# EasyEDA schematic EDA_DriverBoardV1.json
TITLE: Sheet_1; REV: 1.0; Date: 2023-11-25; Sheet: 1/1; Company: Your Company
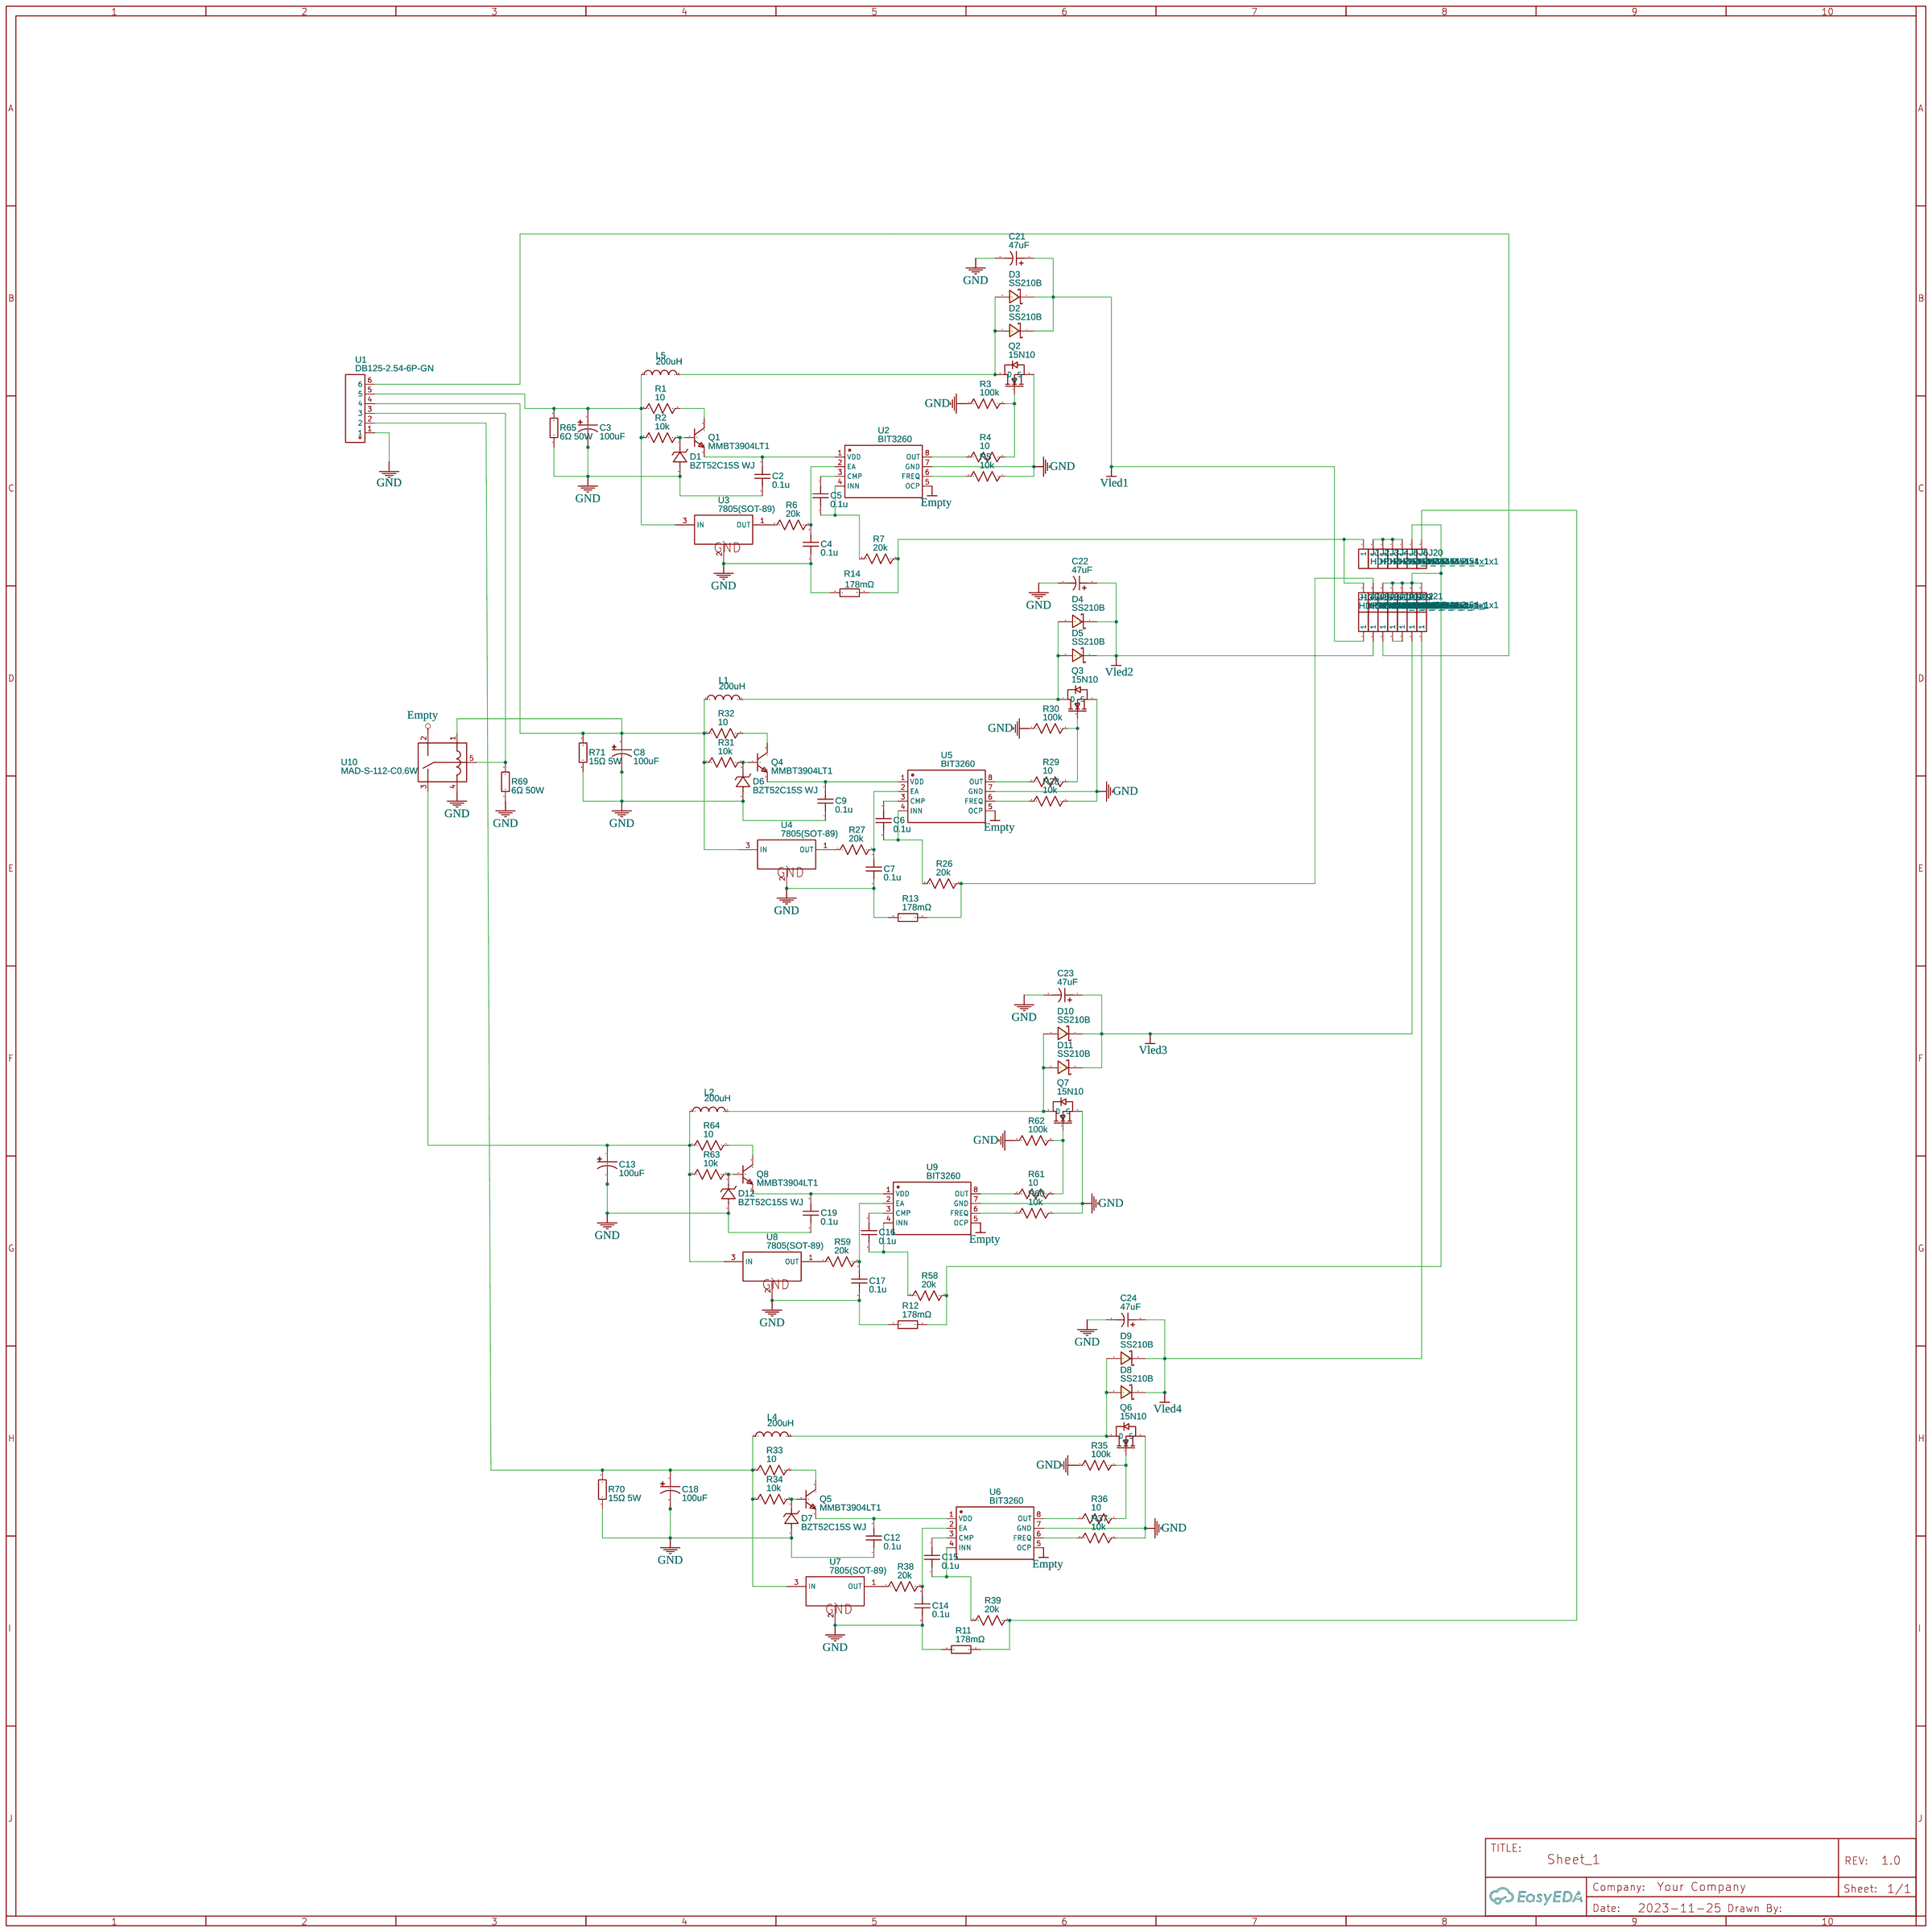
[diagram p0: schematic sheet]

## Parts
C2  0.1u  [C0603]
C3  100uF  [CAP-TH_BD8.0-P3.50-D0.6-FD]
C4  0.1u  [C0603]
C5  0.1u  [C0603]
C6  0.1u  [C0603]
C7  0.1u  [C0603]
C8  100uF  [CAP-TH_BD8.0-P3.50-D0.6-FD]
C9  0.1u  [C0603]
C12  0.1u  [C0603]
C13  100uF  [CAP-TH_BD8.0-P3.50-D0.6-FD]
C14  0.1u  [C0603]
C15  0.1u  [C0603]
C16  0.1u  [C0603]
C17  0.1u  [C0603]
C18  100uF  [CAP-TH_BD8.0-P3.50-D0.6-FD]
C19  0.1u  [C0603]
C21  47uF  [CAP-TH_BD10.0-P5.00-D1.0-FD]
C22  47uF  [CAP-TH_BD10.0-P5.00-D1.0-FD]
C23  47uF  [CAP-TH_BD10.0-P5.00-D1.0-FD]
C24  47uF  [CAP-TH_BD10.0-P5.00-D1.0-FD]
D1  BZT52C15S WJ  [SOD-323_L1.7-W1.3-LS2.5-RD]
D2  SS210B  [SMB_L4.6-W3.6-LS5.3-RD]
D3  SS210B  [SMB_L4.6-W3.6-LS5.3-RD]
D4  SS210B  [SMB_L4.6-W3.6-LS5.3-RD]
D5  SS210B  [SMB_L4.6-W3.6-LS5.3-RD]
D6  BZT52C15S WJ  [SOD-323_L1.7-W1.3-LS2.5-RD]
D7  BZT52C15S WJ  [SOD-323_L1.7-W1.3-LS2.5-RD]
D8  SS210B  [SMB_L4.6-W3.6-LS5.3-RD]
D9  SS210B  [SMB_L4.6-W3.6-LS5.3-RD]
D10  SS210B  [SMB_L4.6-W3.6-LS5.3-RD]
D11  SS210B  [SMB_L4.6-W3.6-LS5.3-RD]
D12  BZT52C15S WJ  [SOD-323_L1.7-W1.3-LS2.5-RD]
J1  HDR-M-2.54_1x1  [HDR-M-2.54_1X1]
J2  HDR-M-2.54_1x1  [HDR-M-2.54_1X1]
J3  HDR-M-2.54_1x1  [HDR-M-2.54_1X1]
J4  HDR-M-2.54_1x1  [HDR-M-2.54_1X1]
J5  HDR-M-2.54_1x1  [HDR-M-2.54_1X1]
J6  HDR-M-2.54_1x1  [HDR-M-2.54_1X1]
J7  HDR-M-2.54_1x1  [HDR-M-2.54_1X1]
J8  HDR-M-2.54_1x1  [HDR-M-2.54_1X1]
J9  HDR-M-2.54_1x1  [HDR-M-2.54_1X1]
J10  HDR-M-2.54_1x1  [HDR-M-2.54_1X1]
J11  HDR-M-2.54_1x1  [HDR-M-2.54_1X1]
J12  HDR-M-2.54_1x1  [HDR-M-2.54_1X1]
J13  HDR-M-2.54_1x1  [HDR-M-2.54_1X1]
J14  HDR-M-2.54_1x1  [HDR-M-2.54_1X1]
J15  HDR-M-2.54_1x1  [HDR-M-2.54_1X1]
J16  HDR-M-2.54_1x1  [HDR-M-2.54_1X1]
J17  HDR-M-2.54_1x1  [HDR-M-2.54_1X1]
J18  HDR-M-2.54_1x1  [HDR-M-2.54_1X1]
J19  HDR-M-2.54_1x1  [HDR-M-2.54_1X1]
J20  HDR-M-2.54_1x1  [HDR-M-2.54_1X1]
J21  HDR-M-2.54_1x1  [HDR-M-2.54_1X1]
L1  200uH  [IND-SMD_L5.0-W5.0_FNR50XXS]
L2  200uH  [IND-SMD_L5.0-W5.0_FNR50XXS]
L4  200uH  [IND-SMD_L5.0-W5.0_FNR50XXS]
L5  200uH  [IND-SMD_L5.0-W5.0_FNR50XXS]
Q1  MMBT3904LT1  [SOT-23-3_L3.0-W1.7-P0.95-LS2.9-BR]
Q2  15N10  [TO-252-3_L6.5-W5.8-P4.58-LS9.8-BR]
Q3  15N10  [TO-252-3_L6.5-W5.8-P4.58-LS9.8-BR]
Q4  MMBT3904LT1  [SOT-23-3_L3.0-W1.7-P0.95-LS2.9-BR]
Q5  MMBT3904LT1  [SOT-23-3_L3.0-W1.7-P0.95-LS2.9-BR]
Q6  15N10  [TO-252-3_L6.5-W5.8-P4.58-LS9.8-BR]
Q7  15N10  [TO-252-3_L6.5-W5.8-P4.58-LS9.8-BR]
Q8  MMBT3904LT1  [SOT-23-3_L3.0-W1.7-P0.95-LS2.9-BR]
R1  10  [R0603]
R2  10k  [R0603]
R3  100k  [R0603]
R4  10  [R0603]
R5  10k  [R0603]
R6  20k  [R0603]
R7  20k  [R0603]
R11  178mΩ  [R1206]
R12  178mΩ  [R1206]
R13  178mΩ  [R1206]
R14  178mΩ  [R1206]
R26  20k  [R0603]
R27  20k  [R0603]
R28  10k  [R0603]
R29  10  [R0603]
R30  100k  [R0603]
R31  10k  [R0603]
R32  10  [R0603]
R33  10  [R0603]
R34  10k  [R0603]
R35  100k  [R0603]
R36  10  [R0603]
R37  10k  [R0603]
R38  20k  [R0603]
R39  20k  [R0603]
R58  20k  [R0603]
R59  20k  [R0603]
R60  10k  [R0603]
R61  10  [R0603]
R62  100k  [R0603]
R63  10k  [R0603]
R64  10  [R0603]
R65  6Ω 50W  [RES-TH_BD2.2-L6.5-P10.50-D0.6]
R69  6Ω 50W  [RES-TH_BD2.2-L6.5-P10.50-D0.6]
R70  15Ω 5W  [RES-TH_BD2.2-L6.5-P10.50-D0.6]
R71  15Ω 5W  [RES-TH_BD2.2-L6.5-P10.50-D0.6]
U1  DB125-2.54-6P-GN  [CONN-TH_DB125-2.54-6P-GN]
U2  BIT3260  [SOP-8_L5.0-W4.0-P1.27-LS6.2-BL]
U3  7805(SOT-89)  [SOT-89-3_L4.5-W2.5-P1.50-LS4.2-BR]
U4  7805(SOT-89)  [SOT-89-3_L4.5-W2.5-P1.50-LS4.2-BR]
U5  BIT3260  [SOP-8_L5.0-W4.0-P1.27-LS6.2-BL]
U6  BIT3260  [SOP-8_L5.0-W4.0-P1.27-LS6.2-BL]
U7  7805(SOT-89)  [SOT-89-3_L4.5-W2.5-P1.50-LS4.2-BR]
U8  7805(SOT-89)  [SOT-89-3_L4.5-W2.5-P1.50-LS4.2-BR]
U9  BIT3260  [SOP-8_L5.0-W4.0-P1.27-LS6.2-BL]
U10  MAD-S-112-C0.6W  [RELAY-TH_MEISHUO_MAD-S-1XX-CXX]

## Library data of the parts
C2 C4-C7 C9 C12 C14-C17 C19 = C_0603_US: Contributor: LCEDA_Lib
C3 C8 C13 C18 = SPZ1HM101F09O00RAXXX: Contributor: LCSC; Supplier: LCSC; Supplier Part: C171434; Manufacturer: AISHI(艾华集团); JLCPCB Part Class: Extended Part; link: https://lcsc.com/eda_search?q=C171434&%26type=1&ref=editor
C21-C24 = SPZ1KM470G12O00RAXXX: Contributor: LCSC; Supplier: LCSC; Supplier Part: C2688263; Manufacturer: AISHI(艾华集团); JLCPCB Part Class: Extended Part; link: https://lcsc.com/eda_search?q=C2688263&%26type=1&ref=editor
D1 D6 D7 D12 = BZT52C15S WJ: Contributor: lcsc; Supplier: LCSC; Supplier Part: C2886375; Manufacturer: CBI(创基); JLCPCB Part Class: Extended Part; link: https://lcsc.com/eda_search?q=C2886375&%26type=1&ref=editor
D2-D5 D8-D11 = SS210B: Contributor: LCSC; Supplier: LCSC; Supplier Part: C353189; Manufacturer: 晶导微电子; JLCPCB Part Class: Extended Part; link: https://lcsc.com/eda_search?q=C353189&%26type=1&ref=editor
J1-J21 = HDR-M-2.54_1x1: Supplier Part: C81276; Supplier: LCSC; Contributor: LCEDA_Lib
L1 L2 L4 L5 = FNR5020S201MT: Contributor: LCSC; Supplier: LCSC; Manufacturer: cjiang(长江微电); Supplier Part: C167949; JLCPCB Part Class: Extended Part; link: https://lcsc.com/eda_search?q=C167949&%26type=1&ref=editor
Q1 Q4 Q5 Q8 = MMBT3904LT1: Contributor: LCSC; Supplier: LCSC; Supplier Part: C402272; Manufacturer: LGE(鲁光); JLCPCB Part Class: Extended Part; link: https://lcsc.com/eda_search?q=C402272&%26type=1&ref=editor
Q2 Q3 Q6 Q7 = 15N10: Contributor: LCSC; Supplier: LCSC; Supplier Part: C2911515; Manufacturer: TF(拓锋); JLCPCB Part Class: Extended Part; link: https://lcsc.com/eda_search?q=C2911515&%26type=1&ref=editor
R1-R7 R26-R39 R58-R64 = R_0603_US: Contributor: LCEDA_Lib
R11-R14 = RTT06R180FTP: Supplier: LCSC; Manufacturer: RALEC(旺诠); Supplier Part: C104934; JLCPCB Part Class: Extended Part; link: https://lcsc.com/eda_search?q=C104934&%26type=1&ref=editor
R65 R69-R71 = CFR0W4J0120A50: Supplier: LCSC; Manufacturer: UNI-ROYAL(厚声); Supplier Part: C70816; JLCPCB Part Class: Extended Part; link: https://lcsc.com/eda_search?q=C70816&%26type=1&ref=editor
U1 = DB125-2.54-6P-GN: Contributor: LCSC; Supplier: LCSC; Supplier Part: C918124; Manufacturer: DIBO(地博电气); Manufacturer Part: DB125-2.54-6P-GN-S; JLCPCB Part Class: Extended Part; link: https://lcsc.com/eda_search?q=C918124&%26type=1&ref=editor
U2 U5 U6 U9 = BIT3260: Supplier: LCSC; Manufacturer: null; Supplier Part: C82675; JLCPCB Part Class: Extended Part; link: https://lcsc.com/eda_search?q=C82675&%26type=1&ref=editor
U3 U4 U7 U8 = 7805(SOT-89): Supplier: LCSC; Manufacturer: CJ; Manufacturer Part: CJ78L05; image: //image.lceda.cn/szlcsc/C2079.jpg; Supplier Part: C2079; Paste Type: expand; Contributor: LCEDA_Lib
U10 = MAD-S-112-C0.6W: Contributor: lcsc; Supplier: LCSC; Supplier Part: C2886813; Manufacturer: MEISHUO(美硕); JLCPCB Part Class: Extended Part; link: https://lcsc.com/eda_search?q=C2886813&%26type=1&ref=editor

## Nets
GND: C2.1 C3.2 C4.1 C7.1 C8.2 C9.1 C12.1 C13.2 C14.1 C17.1 C18.2 C19.1 C21.2 C22.2 C23.2 C24.2 D1.2(A) D6.2(A) D7.2(A) D12.2(A) Q2.3(S) Q3.3(S) Q6.3(S) Q7.3(S) R3.1 R5.1 R11.1 R12.1 R13.1 R14.1 R28.1 R30.1 R35.1 R37.1 R60.1 R62.1 R65.1 R69.1 R70.1 R71.1 U1.1 U2.7(GND) U3.2(GND) U4.2(GND) U5.7(GND) U6.7(GND) U7.2(GND) U8.2(GND) U9.7(GND) U10.4
Empty: U2.5(OCP) U5.5(OCP) U6.5(OCP) U9.5(OCP) U10.2
Vled1: C21.1 D2.1(K) D3.1(K) J13.1
Vled2: C22.1 D4.1(K) D5.1(K) J14.1
Vled3: C23.1 D10.1(K) D11.1(K) J18.1
Vled4: C24.1 D8.1(K) D9.1(K) J19.1
Net-(C2-2): C2.2 Q1.2(E) U2.1(VDD)
Net-(C3-1): C3.1 L5.1 R1.1 R2.1 R65.2 U1.5 U3.3(IN)
Net-(C4-2): C4.2 R6.2 U2.2(EA)
Net-(C5-1): C5.1 U2.3(CMP)
Net-(C5-2): C5.2 R7.2 U2.4(INN)
Net-(C6-1): C6.1 U5.3(CMP)
Net-(C6-2): C6.2 R26.2 U5.4(INN)
Net-(C7-2): C7.2 R27.2 U5.2(EA)
Net-(C8-1): C8.1 L1.1 R31.1 R32.1 R71.2 U1.4 U4.3(IN) U10.1
Net-(C9-2): C9.2 Q4.2(E) U5.1(VDD)
Net-(C12-2): C12.2 Q5.2(E) U6.1(VDD)
Net-(C13-1): C13.1 L2.1 R63.1 R64.1 U8.3(IN) U10.3
Net-(C14-2): C14.2 R38.2 U6.2(EA)
Net-(C15-1): C15.1 U6.3(CMP)
Net-(C15-2): C15.2 R39.2 U6.4(INN)
Net-(C16-1): C16.1 U9.3(CMP)
Net-(C16-2): C16.2 R58.2 U9.4(INN)
Net-(C17-2): C17.2 R59.2 U9.2(EA)
Net-(C18-1): C18.1 L4.1 R33.1 R34.1 R70.2 U1.2 U7.3(IN)
Net-(C19-2): C19.2 Q8.2(E) U9.1(VDD)
Net-(D1-1): D1.1(K) Q1.1(B) R2.2
Net-(D2-2): D2.2(A) D3.2(A) L5.2 Q2.2(D)
Net-(D4-2): D4.2(A) D5.2(A) L1.2 Q3.2(D)
Net-(D6-1): D6.1(K) Q4.1(B) R31.2
Net-(D7-1): D7.1(K) Q5.1(B) R34.2
Net-(D8-2): D8.2(A) D9.2(A) L4.2 Q6.2(D)
Net-(D10-2): D10.2(A) D11.2(A) L2.2 Q7.2(D)
Net-(D12-1): D12.1(K) Q8.1(B) R63.2
Net-(J1-1): J1.1 J7.1 R7.1 R14.2
Net-(J2-1): J2.1 J3.1 J4.1 J5.1
Net-(J6-1): J6.1 J9.1 J10.1 J11.1 J12.1 J21.1 R12.2 R58.1
Net-(J8-1): J8.1 R13.2 R26.1
Net-(J15-1): J15.1 U1.6
Net-(J16-1): J16.1 J17.1
Net-(J20-1): J20.1 R11.2 R39.1
Net-(Q1-3): Q1.3(C) R1.2
Net-(Q2-1): Q2.1(G) R3.2 R4.2
Net-(Q3-1): Q3.1(G) R29.2 R30.2
Net-(Q4-3): Q4.3(C) R32.2
Net-(Q5-3): Q5.3(C) R33.2
Net-(Q6-1): Q6.1(G) R35.2 R36.2
Net-(Q7-1): Q7.1(G) R61.2 R62.2
Net-(Q8-3): Q8.3(C) R64.2
Net-(R4-1): R4.1 U2.8(OUT)
Net-(R5-2): R5.2 U2.6(FREQ)
Net-(R6-1): R6.1 U3.1(OUT)
Net-(R27-1): R27.1 U4.1(OUT)
Net-(R28-2): R28.2 U5.6(FREQ)
Net-(R29-1): R29.1 U5.8(OUT)
Net-(R36-1): R36.1 U6.8(OUT)
Net-(R37-2): R37.2 U6.6(FREQ)
Net-(R38-1): R38.1 U7.1(OUT)
Net-(R59-1): R59.1 U8.1(OUT)
Net-(R60-2): R60.2 U9.6(FREQ)
Net-(R61-1): R61.1 U9.8(OUT)
Net-(R69-2): R69.2 U1.3 U10.5
